# EAGLE schematic binary counter down (EAGLE 6.3)
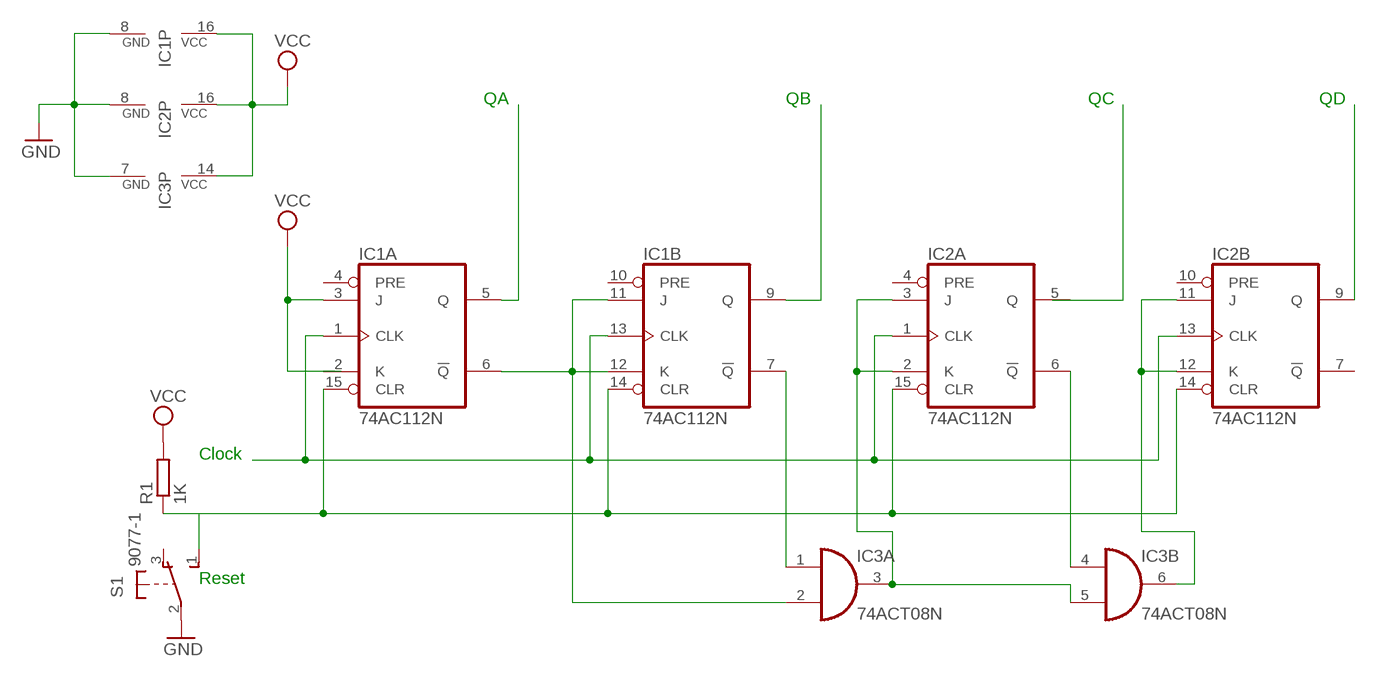
[diagram p0: schematic, sheet 1]

## Parts
IC1  74AC112N  [DIL16]
IC2  74AC112N  [DIL16]
IC3  74ACT08N  [DIL14]
R1  1K  R-EU_0204/7  [0204/7]
S1  9077-1  [9077-1]

## Nets
GND: IC1.8(P:GND) IC2.8(P:GND) IC3.7(P:GND) S1.2(P)
N$1: IC1.1(A:CLK) IC1.13(B:CLK) IC2.1(A:CLK) IC2.13(B:CLK)
N$2: IC1.6(A:!Q) IC1.11(B:J) IC1.12(B:K) IC3.2(A:I1)
N$3: IC1.5(A:Q)
N$4: IC1.9(B:Q)
N$5: IC1.7(B:!Q) IC3.1(A:I0)
N$6: IC1.14(B:CLR) IC1.15(A:CLR) IC2.14(B:CLR) IC2.15(A:CLR) R1.1 S1.1(S)
N$8: IC2.2(A:K) IC2.3(A:J) IC3.3(A:O) IC3.5(B:I1)
N$9: IC2.9(B:Q)
N$10: IC2.6(A:!Q) IC3.4(B:I0)
N$11: IC2.11(B:J) IC2.12(B:K) IC3.6(B:O)
VCC: IC1.3(A:J) IC1.16(P:VCC) IC2.16(P:VCC) IC3.14(P:VCC) R1.2
Unconnected: IC1.2(A:K) IC1.4(A:PRE) IC1.10(B:PRE) IC2.4(A:PRE) IC2.5(A:Q) IC2.7(B:!Q) IC2.10(B:PRE) IC3.8(C:O) IC3.9(C:I0) IC3.10(C:I1) IC3.11(D:O) IC3.12(D:I0) IC3.13(D:I1) S1.3(O)

## Notes on the sheet
- QA | QB | QC | QD
- Clock
- Reset

## Library data of the parts
IC1 IC2 = 74xx-eu:74*112: Dual J-K negative edge triggered FLIP FLOP, preset and clear
IC3 = 74xx-eu:74*08: Quad 2-input AND gate
R1 = rcl:R-EU_: RESISTOR, European symbol
S1 = switch-misc:9077-1: MARQUARDT SWITCH 9077.0100 Distributor: Buerklin <https://www.buerklin.com/default.asp?event=ShowArtikel%2812G2820%29&l=d&jump=ArtNr_12G2820>